# EAGLE design CO2 Sensor V1.0 (EAGLE 6.1)
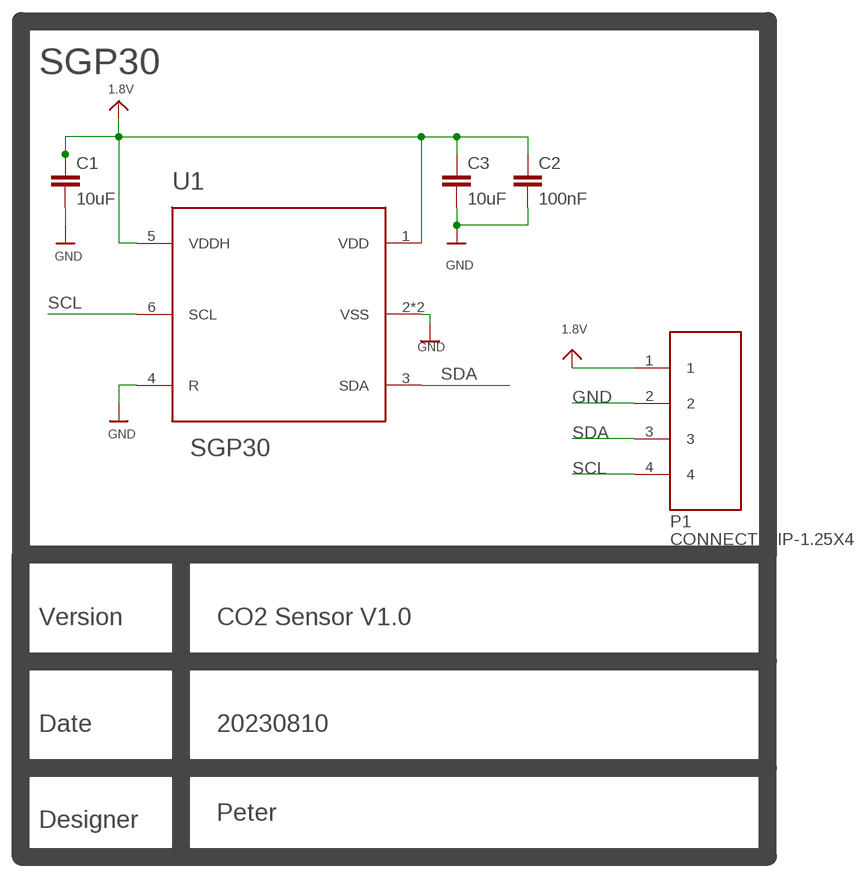
[diagram p0: schematic, sheet 1]

## Parts
C1  10uF  C0603  [C0603]
C2  100nF  C0603  [C0603]
C3  10uF  C0603  [C0603]
P1  CONNECT-DIP-1.25X4  [CONNECT-DIP-1.25X4]
U1  SGP30  [SGP30]

## Nets
1.8V: C1.1 C2.1 C3.1 P1.1 U1.1(VDD) U1.5(VDDH)
GND: C1.2 C2.2 C3.2 P1.2 U1.2(VSS) U1.4(R) U1.P$7(VSS)
SCL: P1.4 U1.6(SCL)
SDA: P1.3 U1.3(SDA)

## Notes on the sheet
- SGP30
- Version | CO2 Sensor V1.0
- Date | 20230810
- Peter
- Designer

## Library data of the parts
C1-C3 = Makerfabs-Peter:C0603
P1 = Makerfabs-Peter:CONNECT-DIP-1.25X4
U1 = SGP30 Rev D:SGP30: Sensirion SGP30 multi-pixel gas sensor

## Board
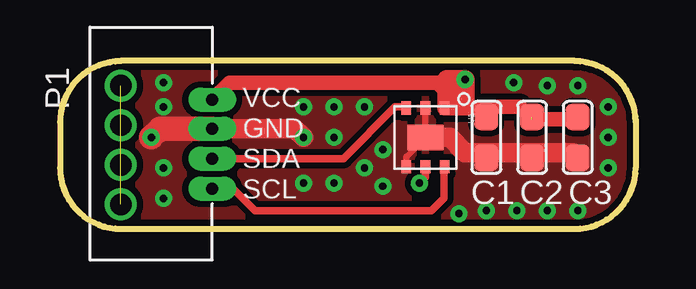
[diagram p1: board, top side]
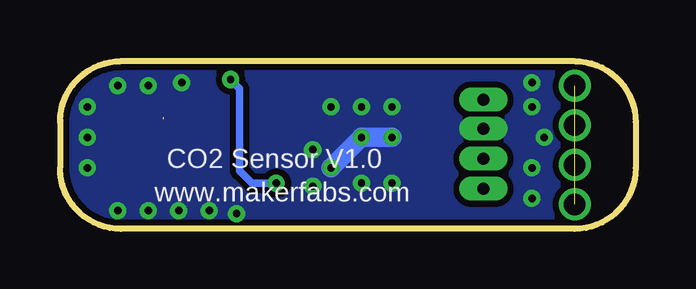
[diagram p2: board, bottom side, seen from below]

Size 24 x 7 mm. Coordinates in mm from the lower left corner, seen from the top.
Outline: 21.46,7 2.54,7
Outline: 24,4.45 arc90 21.46,6.99
Outline: 24,4.57 24,2.54 arc-90 21.46,0 2.54,0 arc-90 0,2.54 0,4.45 arc-90 2.54,6.99
Copper layers (1*16): Top 0.035mm / dielectric 1.5mm / Bottom 0.035mm
Design rules: minimum track width 10mil, minimum drill 12mil, track to track 8mil, track to pad 8mil, pad to pad 8mil, via to via 8mil, smd to smd 0mil, copper to edge 10mil, drill to drill 8mil, minimum pad ring 10mil, minimum via ring 8mil, stop-mask expansion 0mil, vias tented up to drill 0mil, thermal gap 0mil

### Footprints (pad centres in the part's own frame; a part is rotated, then mirrored left to right if it is on the bottom)
C0603 = smd 1.1 x 1: 1 -0.85,0; 2 0.85,0
CONNECT-DIP-1.25X4 = drill 0.5 long: 1 -1.825,2.54; 2 -0.625,2.54; 3 0.625,2.54; 4 1.875,2.54
SGP30 = smd 0.55 x 0.4: 1 -1.225,0.8; 2 -1.225,0; 3 -1.225,-0.8; 4 1.225,-0.8; 5 1.225,0; 6 1.225,0.8 | smd 1.05 x 1.5: P$7 0,0

### Placement (x,y rotation side)
C1  17.78,3.81 270 top
C2  19.68,3.81 270 top
C3  21.59,3.81 270 top
P1  3.81,3.56 270 top
U1  15.24,3.81 270 top

### Tracks (layer width: path | path; a pad name or v marks a point on that pad's centre or on a via)
1.8V  (via drill 0.3)  (1 unrouted)
  Top 0.254: C3.1 21.04,4.66 20.95,4.57 | 17.73,5.04 17.73,4.71 C1.1 | U1.5 15.24,2.54 | 15.75,6.1 16.26,6.1 | 16.26,6.1 16.51,6.35 16.76,6.35 v16.89,6.22 | 16.26,6.1 16.38,6.1
  Top 0.305: 16.89,5.46 16.51,5.08 | U1.5 15.24,2.16 v14.99,1.91
  Top 0.61: 21.21,4.57 20.95,4.57 19.68,4.57 19.18,5.08 17.78,5.08 17.73,5.04 U1.1 16.04,5.8 15.75,6.1 7.07,6.1 P1.1
  Top 0.813: 16.89,5.46 v16.89,6.22 16.13,6.22 | 16.38,5.33 16.38,6.1
  Bottom 0.305: v14.99,1.91 16,1.91 16.51,2.41 16.51,5.84 v16.89,6.22
GND  (via drill 0.3)
  Top 0.254: U1.4 14.44,3.01 U1.P$7 U1.2 | 21.38,3.17 19.9,3.17 C2.2 | C1.2 17.11,2.96 16.89,3.17
  Top 0.813: U1.P$7 16.26,3.81 16.89,3.17 21.38,3.17 C3.2 | P1.2 9.79,4.18 v10.16,3.81
  Top 1.016: P1.2 4.18,4.18 v3.81,3.81
  Bottom 0.813: v10.16,3.81 v11.43,3.81 v12.7,2.54
  other vias: 21.59,5.97 16.64,0.64 4.32,1.27 4.32,2.54 4.32,5.08 22.86,2.54 22.86,3.81 22.86,5.08 20.32,5.97 17.78,0.76 19.05,0.76 20.32,0.76 20.32,0.76 21.59,0.76 12.7,5.08 18.92,6.1 10.16,5.08 11.43,5.08 13.46,3.3 10.16,1.91 11.43,1.91 13.46,1.78 4.32,6.1
  pour Top (isolate 0.254, rank 6): -1.27,10.16 -1.27,-1.27 25.4,-1.27 25.4,10.16
  pour Bottom (isolate 0.254, rank 6): -2.54,11.43 -2.54,-2.54 26.67,-2.54 26.67,11.43
N$1  (via drill 0.89)  (3 unrouted)
  other vias: 2.54,5.97 2.54,4.32 2.54,2.67 2.54,1.02
SCL  (1 unrouted)
  Top 0.305: P1.4 7.21,1.68 8.13,0.76 15.49,0.76 16,1.27 16,2.54 | 16,2.55 U1.6
SDA
  Top 0.305: P1.3 11.82,2.93 13.97,5.08 14.39,5.08 U1.3

### Text on the board
tPlace: VCC | GND | SDA | SCL
bPlace: CO2 Sensor V1.0 | www.makerfabs.com